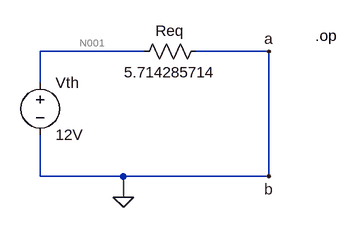
[diagram p0: schematic Thévenin.asc]
Thévenin.asc, the LTspice schematic file:
Version 4
SHEET 1 880 680
WIRE 256 32 96 32
WIRE 448 32 336 32
WIRE 96 80 96 32
WIRE 96 224 96 160
WIRE 224 224 96 224
WIRE 448 224 448 32
WIRE 448 224 224 224
WIRE 224 256 224 224
FLAG 448 32 a
FLAG 448 224 b
FLAG 224 256 0
SYMBOL res 240 48 R270
WINDOW 0 32 56 VTop 2
WINDOW 3 0 56 VBottom 2
SYMATTR InstName Req
SYMATTR Value 5.714285714
SYMBOL voltage 96 64 R0
SYMATTR InstName Vth
SYMATTR Value 12V
TEXT 520 8 Left 2 !.op

The netlist it stands for:
* Thévenin.asc
Req N001 0 5.714285714
Vth N001 0 12V
.op
.backanno
.end

* Results of the author's LTspice run, read from the files saved beside the schematic
* Operating Point:
*   V(n001) = 12 V
*   I(Req) = 2.1 A
*   I(Vth) = -2.1 A